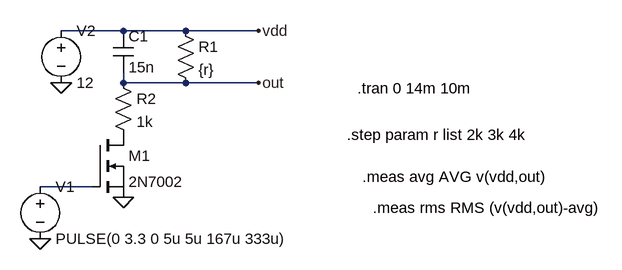
[diagram p0: schematic buzzer.asc]
buzzer.asc, the LTspice schematic file:
Version 4.1
SHEET 1 1096 680
WIRE 256 -48 160 -48
WIRE 352 -48 256 -48
WIRE 464 -48 352 -48
WIRE 256 32 256 16
WIRE 352 32 256 32
WIRE 464 32 352 32
WIRE 208 192 128 192
FLAG 256 208 0
FLAG 128 272 0
FLAG 160 32 0
FLAG 464 32 out
FLAG 464 -48 vdd
SYMBOL nmos 208 112 R0
SYMATTR InstName M1
SYMATTR Value 2N7002
SYMBOL voltage 128 176 R0
WINDOW 123 0 0 Left 0
WINDOW 39 0 0 Left 0
SYMATTR InstName V1
SYMATTR Value PULSE(0 3.3 0 5u 5u 167u 333u)
SYMBOL cap 240 -48 R0
SYMATTR InstName C1
SYMATTR Value 15n
SYMBOL res 336 -64 R0
SYMATTR InstName R1
SYMATTR Value {r}
SYMBOL res 240 16 R0
SYMATTR InstName R2
SYMATTR Value 1k
SYMBOL voltage 160 -64 R0
WINDOW 123 0 0 Left 0
WINDOW 39 0 0 Left 0
SYMATTR InstName V2
SYMATTR Value 12
TEXT 616 40 Left 2 !.tran 0 14m 10m
TEXT 600 112 Left 2 !.step param r list 2k 3k 4k
TEXT 624 176 Left 2 !.meas avg AVG v(vdd,out)
TEXT 640 224 Left 2 !.meas rms RMS (v(vdd,out)-avg)

The netlist it stands for:
* buzzer.asc
M1 P001 N001 0 0 2N7002
V1 N001 0 PULSE(0 3.3 0 5u 5u 167u 333u)
C1 vdd out 15n
R1 vdd out {r}
R2 out P001 1k
V2 vdd 0 12
.model NMOS NMOS
.model PMOS PMOS
.lib standard.mos
.tran 0 14m 10m
.step param r list 2k 3k 4k
.meas avg AVG v(vdd,out)
.meas rms RMS (v(vdd,out)-avg)
.backanno
.end